# Altium schematic sheet Power_buckConverters.SchDoc
size A
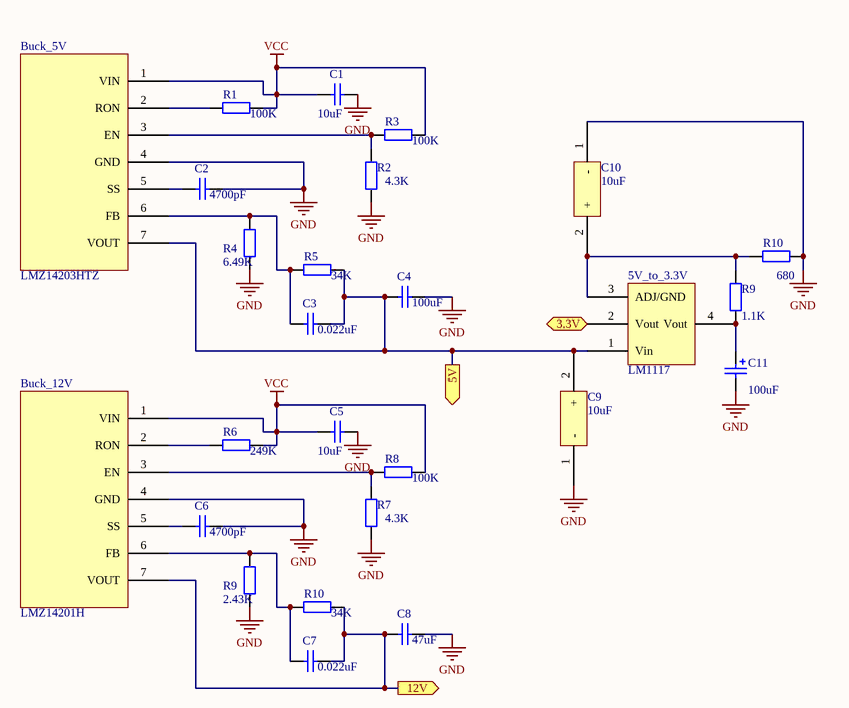
[diagram p0: Power_buckConverters.SchDoc]

## Parts
(Parts that share a designator on the sheet are numbered #1, #2 ... from top to bottom, then left to right.)
5V_to_3.3V  LM1117  [SOT230P700X180-4N]
Buck_5V  LMZ14203HTZ  [PCBComponent_1]
Buck_12V  LMZ14201H  [PCBComponent_1]
C1  value 10uF  [C1206]  (hidden comment: Cap Semi)
C2  value 4700pF  [C1206]  (hidden comment: Cap Semi)
C3  value 0.022uF  [C1206]  (hidden comment: Cap Semi)
C4  value 100uF  [C1206]  (hidden comment: Cap Semi)
C5  value 10uF  [C1206]  (hidden comment: Cap Semi)
C6  value 4700pF  [C1206]  (hidden comment: Cap Semi)
C7  value 0.022uF  [C1206]  (hidden comment: Cap Semi)
C8  value 47uF  [C1206]  (hidden comment: Cap Semi)
C9  10uF  [elec_10uF]
C10  10uF  [elec_10uF]
C11  value 100uF  [POLAR0.8]  (hidden comment: Cap Pol2)
R1  value 100K  [AXIAL-0.4]  (hidden comment: Res2)
R2  value 4.3K  [AXIAL-0.4]  (hidden comment: Res2)
R3  value 100K  [AXIAL-0.4]  (hidden comment: Res2)
R4  value 6.49K  [AXIAL-0.4]  (hidden comment: Res2)
R5  value 34K  [AXIAL-0.4]  (hidden comment: Res2)
R6  value 249K  [AXIAL-0.4]  (hidden comment: Res2)
R7  value 4.3K  [AXIAL-0.4]  (hidden comment: Res2)
R8  value 100K  [AXIAL-0.4]  (hidden comment: Res2)
R9#1  value 1.1K  [AXIAL-0.4]  (hidden comment: Res2)
R9#2  value 2.43K  [AXIAL-0.4]  (hidden comment: Res2)
R10#1  value 680  [AXIAL-0.4]  (hidden comment: Res2)
R10#2  value 34K  [AXIAL-0.4]  (hidden comment: Res2)

## Ports
3.3V (out), 5V (out), 12V (out)

## Nets
GND: Buck_5V.4(GND) Buck_12V.4(GND) C1.2 C2.2 C4.2 C5.2 C6.2 C8.2 C9.1(-) C10.1(-) C11.2 R2.1 R4.1 R7.1 R9#2.1 R10#1.2
VCC: Buck_5V.1(VIN) Buck_12V.1(VIN) C1.1 C5.1 R1.2 R3.2 R6.2 R8.2
3.3V: 5V_to_3.3V.2(Vout) ; port 3.3V
5V: 5V_to_3.3V.1(Vin) Buck_5V.7(VOUT) C3.2 C4.1 C9.2(+) R5.2 ; port 5V
12V: Buck_12V.7(VOUT) C7.2 C8.1 R10#2.2 ; port 12V
Net5V_to_3.3V_3: 5V_to_3.3V.3(ADJ/GND) C10.2(+) R9#1.2 R10#1.1
Net5V_to_3.3V_4: 5V_to_3.3V.4(Vout) C11.1 R9#1.1
NetBuck_5V_2: Buck_5V.2(RON) R1.1
NetBuck_5V_3: Buck_5V.3(EN) R2.2 R3.1
NetBuck_5V_5: Buck_5V.5(SS) C2.1
NetBuck_5V_6: Buck_5V.6(FB) C3.1 R4.2 R5.1
NetBuck_12V_2: Buck_12V.2(RON) R6.1
NetBuck_12V_3: Buck_12V.3(EN) R7.2 R8.1
NetBuck_12V_5: Buck_12V.5(SS) C6.1
NetBuck_12V_6: Buck_12V.6(FB) C7.1 R9#2.2 R10#2.1

## Library data of the parts
5V_to_3.3V Buck_5V Buck_12V C9 C10 = Component_1
C1-C8 = Cap Semi: Capacitor (Semiconductor SIM Model); Published: 8-Jun-2000; LatestRevisionDate: 29-May-2009; LatestRevisionNote: IPC-7351 Footprint Added.; PackageReference: C1206; Publisher: Altium Limited; PackageDescription: Chip Capacitor
C11 = Cap Pol2: Polarized Capacitor (Axial); Published: 8-Jun-2000; LatestRevisionDate: 17-Jul-2002; LatestRevisionNote: Re-released for DXP Platform.; PackageReference: POLAR0.8; Publisher: Altium Limited; PackageDescription: Polarized Capacitor; 2 Leads
R1-R8 R9#1 R9#2 R10#1 R10#2 = Res2: Resistor; Published: 8-Jun-2000; LatestRevisionDate: 17-Jul-2002; LatestRevisionNote: Re-released for DXP Platform.; PackageReference: AXIAL-0.4; Publisher: Altium Limited; PackageDescription: Axial Device, Thru-Hole; 2 Leads; 0.4 in Pin Spacing